# EAGLE schematic power_NAND (EAGLE 8.6.3)
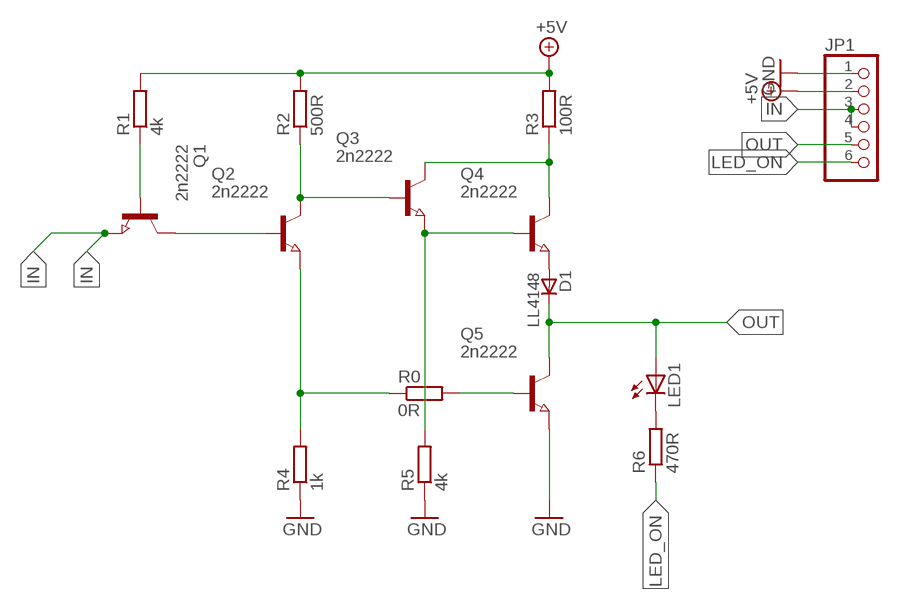
[diagram p0: schematic, sheet 1]

## Parts
D1  LL4148  [SOD80_DO213AA_MINIMELF]
JP1  PINHD-1X06_2.54-SMD-90°  [1X06SMD/90]
LED1  LEDCHIPLED_0805  [CHIPLED_0805]
Q1  2n2222  NPN-TRANSISTOR_SOT23  [SOT23]
Q2  2n2222  NPN-TRANSISTOR_SOT23  [SOT23]
Q3  2n2222  NPN-TRANSISTOR_SOT23  [SOT23]
Q4  2n2222  NPN-TRANSISTOR_SOT23  [SOT23]
Q5  2n2222  NPN-TRANSISTOR_SOT23  [SOT23]
R0  0R  R-EU_R1206  [R1206]
R1  4k  R-EU_R0805  [R0805]
R2  500R  R-EU_R0805  [R0805]
R3  100R  R-EU_R0805  [R0805]
R4  1k  R-EU_R0805  [R0805]
R5  4k  R-EU_R0805  [R0805]
R6  470R  R-EU_R0805  [R0805]

## Nets
+5V: JP1.2 R1.2 R2.2 R3.2
GND: JP1.1 Q5.2(E) R4.1 R5.1
IN: JP1.3 JP1.4 Q1.2(E)
LED_ON: JP1.6 R6.1
N$1: Q1.3(C) Q2.1(B)
N$2: Q1.1(B) R1.1
N$3: Q2.3(C) Q3.1(B) R2.1
N$4: Q2.2(E) R0.1 R4.2
N$5: Q3.3(C) Q4.3(C) R3.1
N$6: Q3.2(E) Q4.1(B) R5.2
N$7: D1.A Q4.2(E)
N$10: LED1.C R6.2
N$11: Q5.1(B) R0.2
OUT: D1.C JP1.5 LED1.A Q5.3(C)

## Library data of the parts
D1 = _hhn_diodes_smd:LL4148: 1N4148 General Purpose Rectifie SMD-Version of 1N4148 Case: SOD 80 = DO 213 AA = MINIMELF (Glass) Author: Dipl.-Ing. FH Rainer Bayer HHN Hochschule Heilbronn, rainer.bayer@hs-heilbronn.de Ingenieurbüro ing-rb, mail@ing-rb.de
JP1 = pinhead-2:PINHD-1X06: PIN HEADER
LED1 = led:LED: LED OSRAM: - CHIPLED LG R971, LG N971, LY N971, LG Q971, LY Q971, LO R971, LY R971 LH N974, LH R974 LS Q976, LO Q976, LY Q976 LO Q996 - Hyper CHIPLED LW Q18S LB Q993, LB Q99A, LB R99A - SideLED LS A670, LO A670, LY A670, LG A670, LP A670 LB A673, LV A673, LT A673, LW A673 LH A674 LY A675 LS A676, LA A676, LO A676, LY A676, LW A676 LS A679, LY A679, LG A679 - Hyper Micro SIDELED® LS Y876, LA Y876, LO Y876, LY Y876 LT Y87S - SmartLED LW L88C, LW L88S LB L89C, LB L89S, LG L890 LS L89K, LO L89K, LY L89K LS L896, LA L896, LO L896, LY L896 - TOPLED LS T670, LO T670, LY T670, LG T670, LP T670 LSG T670, LSP T670, LSY T670, LOP T670, LYG T670 LG T671, LOG T671, LSG T671 LB T673, LV T673, LT T673, LW T673 LH T674 LS T676, LA T676, LO T676, LY T676, LB T676, LH T676, LSB T676, LW T676 LB T67C, LV T67C, LT T67C, LS T67K, LO T67K, LY T67K, LW E67C LS E67B, LA E67B, LO E67B, LY E67B, LB E67C, LV E67C, LT E67C LW T67C LS T679, LY T679, LG T679 LS T770, LO T770, LY T770, LG T770, LP T770 LB T773, LV T773, LT T773, LW T773 LH T774 LS E675, LA E675, LY E675, LS T675 LS T776, LA T776, LO T776, LY T776, LB T776 LHGB T686 LT T68C, LB T68C - Hyper Mini TOPLED® LB M676 - Mini TOPLED Santana® LG M470 LS M47K, LO M47K, LY M47K Source: http://www.osram.convergy.de LUXEON: - LUMILED® LXK2-PW12-R00, LXK2-PW12-S00, LXK2-PW14-U00, LXK2-PW14-V00 LXK2-PM12-R00, LXK2-PM12-S00, LXK2-PM14-U00 LXK2-PE12-Q00, LXK2-PE12-R00, LXK2-PE12-S00, LXK2-PE14-T00, LXK2-PE14-U00 LXK2-PB12-K00, LXK2-PB12-L00, LXK2-PB12-M00, LXK2-PB14-N00, LXK2-PB14-P00, LXK2-PB14-Q00 LXK2-PR12-L00, LXK2-PR12-M00, LXK2-PR14-Q00, LXK2-PR14-R00 LXK2-PD12-Q00, LXK2-PD12-R00, LXK2-PD12-S00 LXK2-PH12-R00, LXK2-PH12-S00 LXK2-PL12-P00, LXK2-PL12-Q00, LXK2-PL12-R00 Source: www.luxeon.com KINGBRIGHT: KA-3528ASYC Source: www.kingbright.com
Q1-Q5 = semicon-smd-ipc:NPN-TRANSISTOR_: NPN TRANSISTOR
R0 R1-R6 = rcl:R-EU_: RESISTOR, European symbol; SPICEPREFIX: R